# EasyEDA Pro project PUB3.epro

# Schematic Schematic1
Create Date: 2024-04-23; Page Name: P1; Project Name: PUB3; Schematic Name: Schematic1; Update Date: 2024-05-03; Company: 嘉立创EDA; Page Size: A4; Version: V1.0
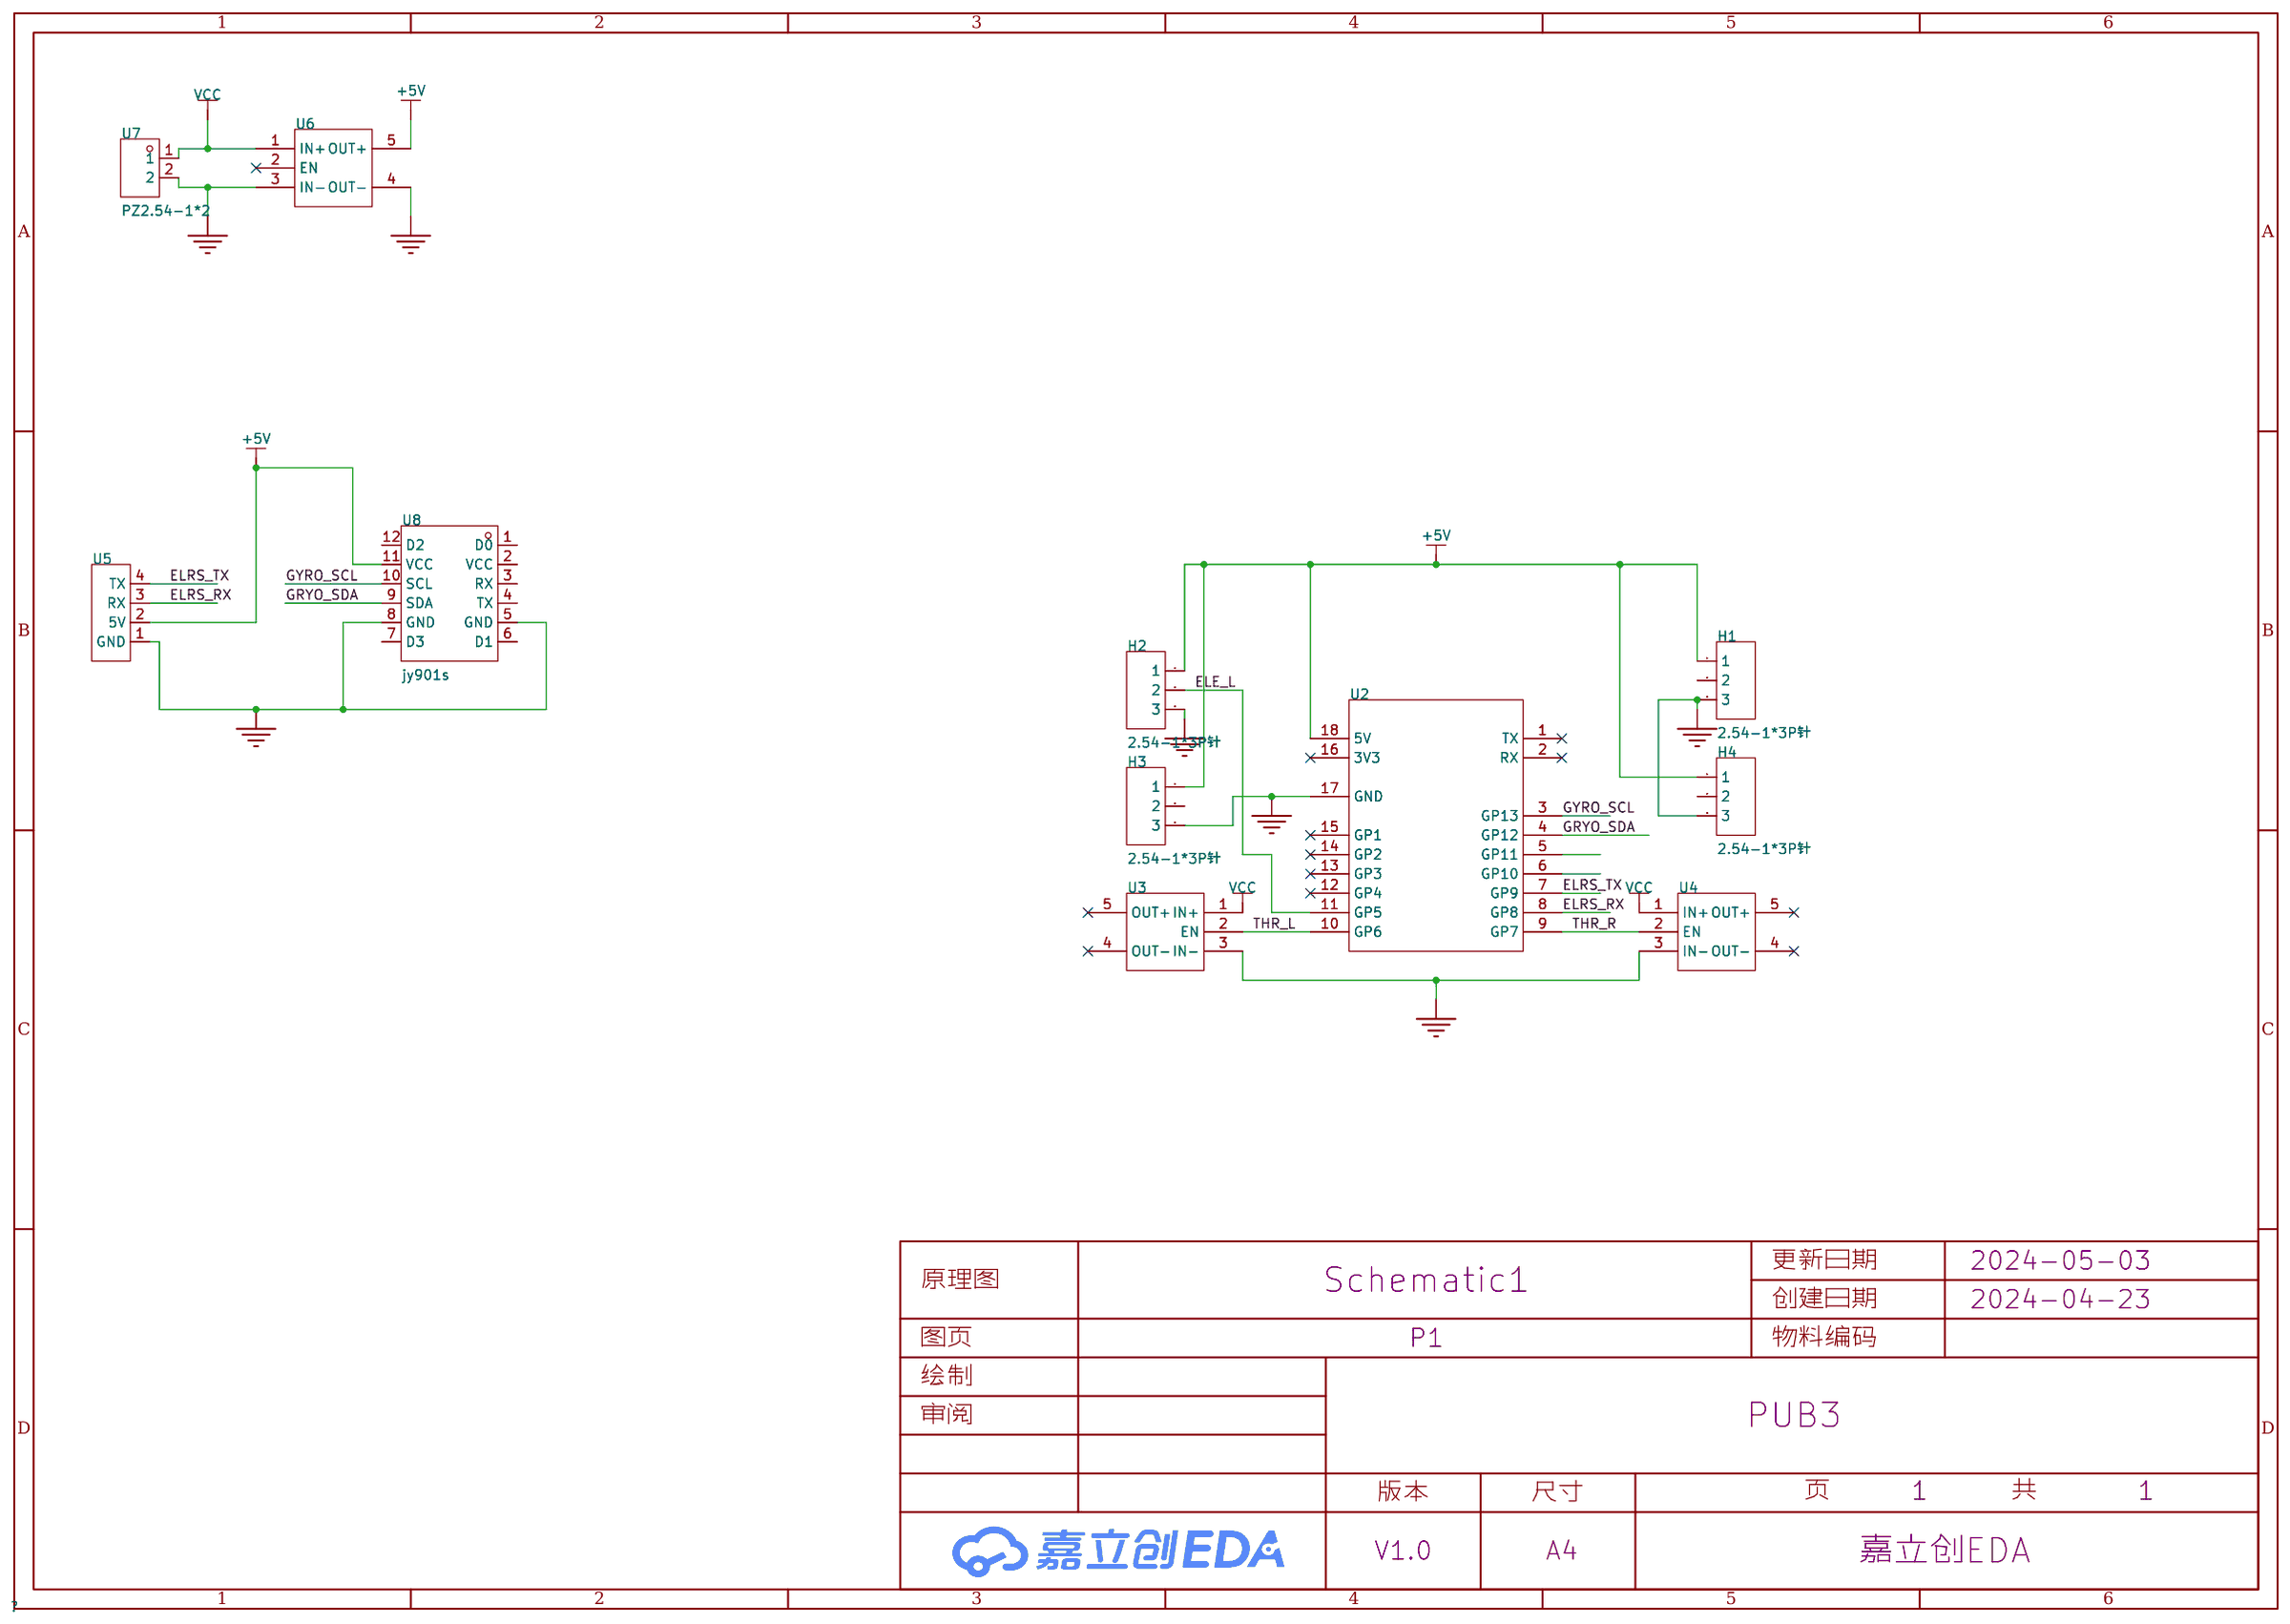
[diagram p0: schematic sheet]

## Parts
H1  2.54-1*3P针  [HDR-TH_3P-P2.54-V-M-1]
H2  2.54-1*3P针  [HDR-TH_3P-P2.54-V-M-1]
H3  2.54-1*3P针  [HDR-TH_3P-P2.54-V-M-1]
H4  2.54-1*3P针  [HDR-TH_3P-P2.54-V-M-1]
U2  -  [ESP32-S3-Zero]
U3  -  [带有使能端的DC-DC降压模块]
U4  -  [带有使能端的DC-DC降压模块]
U5  -  [ELRS焊盘]
U6  -  [带有使能端的DC-DC降压模块]
U7  PZ2.54-1*2  [HDR-TH_2P-P2.54-V-M-3]
U8  jy901s  [COMM-SMD_JY901S-1]

## Library data of the parts
H1-H4 = 2.54-1*3P针: 插针结构:1x3P;间距:2.54mm;行距:-;圆针/方针:方针;安装类型:直插;排数:单排;总PIN位数:3P;额定电流:3A;额定电压:-;配合针长度:-;塑高:-;端接针长度:-;触头材质:-;触头镀层:-;工作温度范围:-40℃~+105℃;颜色:黑色;; LCSC Part Name: 间距:2.54mm 1x3P 直插 方针; Supplier Part: C49257; Manufacturer: BOOMELE(博穆精密); Supplier Footprint: 插件,P=2.54mm; Datasheet: https://atta.szlcsc.com/upload/public/pdf/source/20221018/3E9408392E35E6F57A28985E5F7BF5C9.pdf; Supplier: LCSC; Pin Structure: 1x3P; Pitch: 2.54mm; Circluar Pins/Square Pins: 方针; Mounting Type: 直插; Number of Rows: 单排; Number of Pins: 3P; Current Rating (Max): 3A; Operating Temperature Range: -40℃~+105℃; Color: 黑色
U2 = ESP32-S3-Zero
U3 U4 U6 = 带有使能端的DC-DC降压模块
U5 = ELRS焊盘
U7 = PZ2.54-1*2: Supplier Part: C5360898; Manufacturer: ZHOURI(洲日); Supplier Footprint: 插件,P=2.54mm; JLCPCB Part Class: 扩展库; Datasheet: https://atta.szlcsc.com/upload/public/pdf/source/20220323/224B1BE3995440B78463F26874D564A6.pdf; Supplier: LCSC
U8 = jy901s: Supplier Part: C9900019525; Supplier Footprint: SMD; JLCPCB Part Class: 扩展库; Supplier: LCSC

## Nets
+5V: H1.1 H2.1 H3.1 H4.1 U2.18(5V) U5.2(5V) U6.5(OUT+) U8.11(VCC)
GND: H1.3 H2.3 H3.3 H4.3 U2.17(GND) U3.3(IN-) U4.3(IN-) U5.1(GND) U6.3(IN-) U6.4(OUT-) U7.2 U8.5(GND) U8.8(GND)
VCC: U3.1(IN+) U4.1(IN+) U6.1(IN+) U7.1
ELE_L: H2.2 U2.11(GP5)
ELRS_RX: U2.8(GP8) U5.3(RX)
ELRS_TX: U2.7(GP9) U5.4(TX)
GRYO_SDA: U2.4(GP12) U8.9(SDA)
GYRO_SCL: U2.3(GP13) U8.10(SCL)
THR_L: U2.10(GP6) U3.2(EN)
THR_R: U2.9(GP7) U4.2(EN)

Not connected (* = marked no-connect by the designer): H1 2; H3 2; H4 2; U2 1(TX)* 2(RX)* 5(GP11) 6(GP10) 12(GP4)* 13(GP3)* 14(GP2)* 15(GP1)* 16(3V3)*; U3 4(OUT-)* 5(OUT+)*; U4 4(OUT-)* 5(OUT+)*; U6 2(EN)*; U8 1(D0) 2(VCC) 3(RX) 4(TX) 6(D1) 7(D3) 12(D2)

# Board PCB1
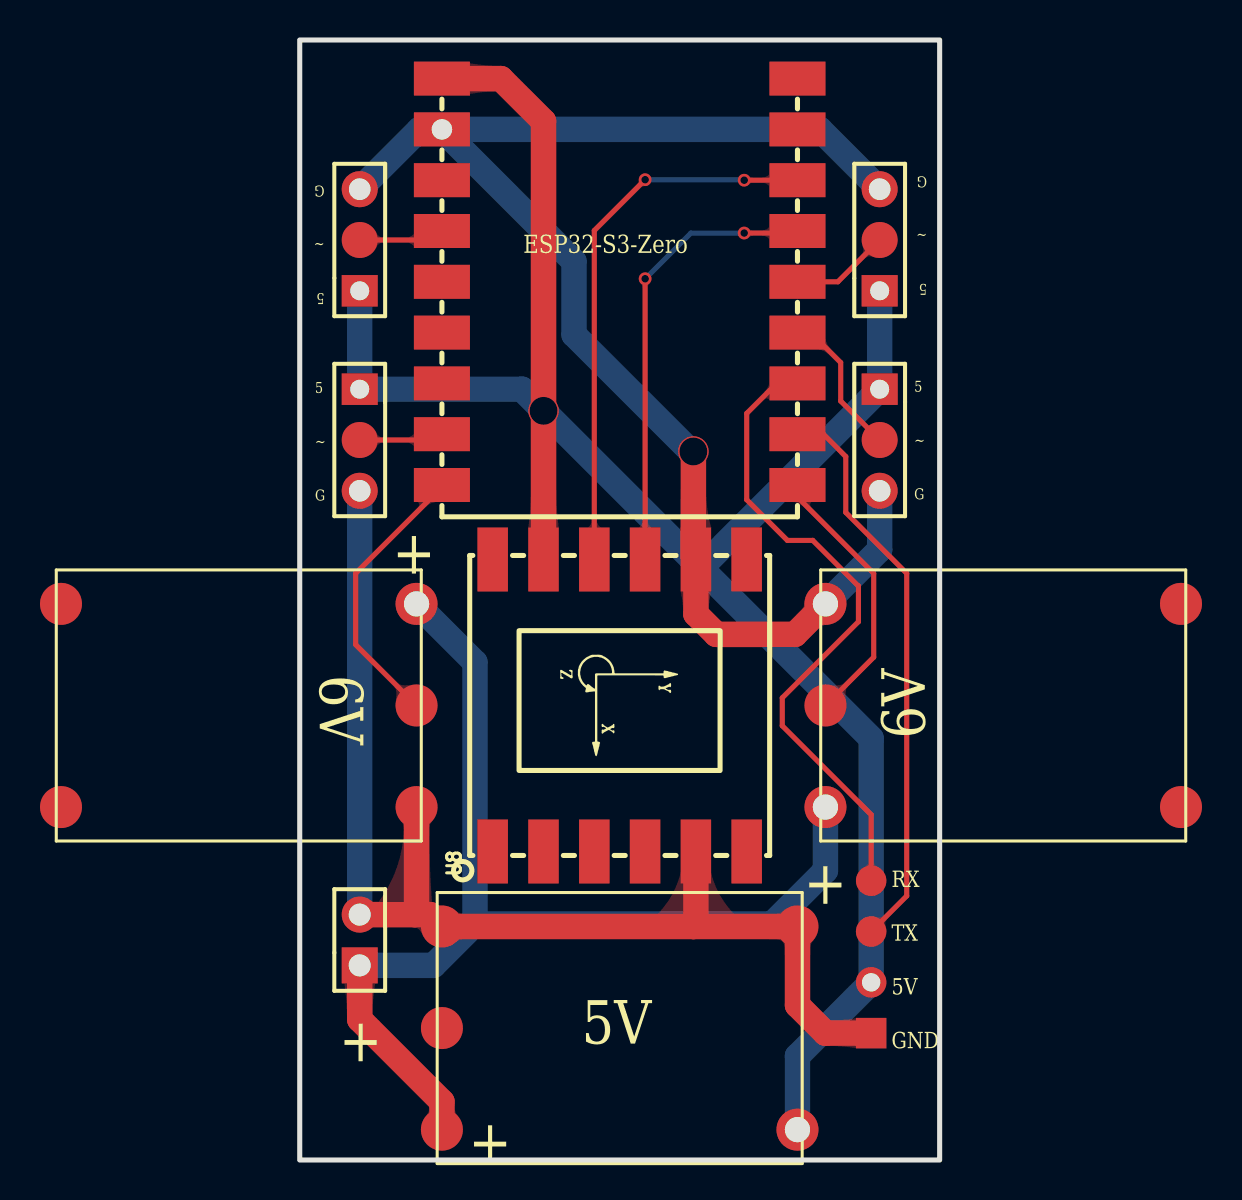
[diagram p1: board, top side]
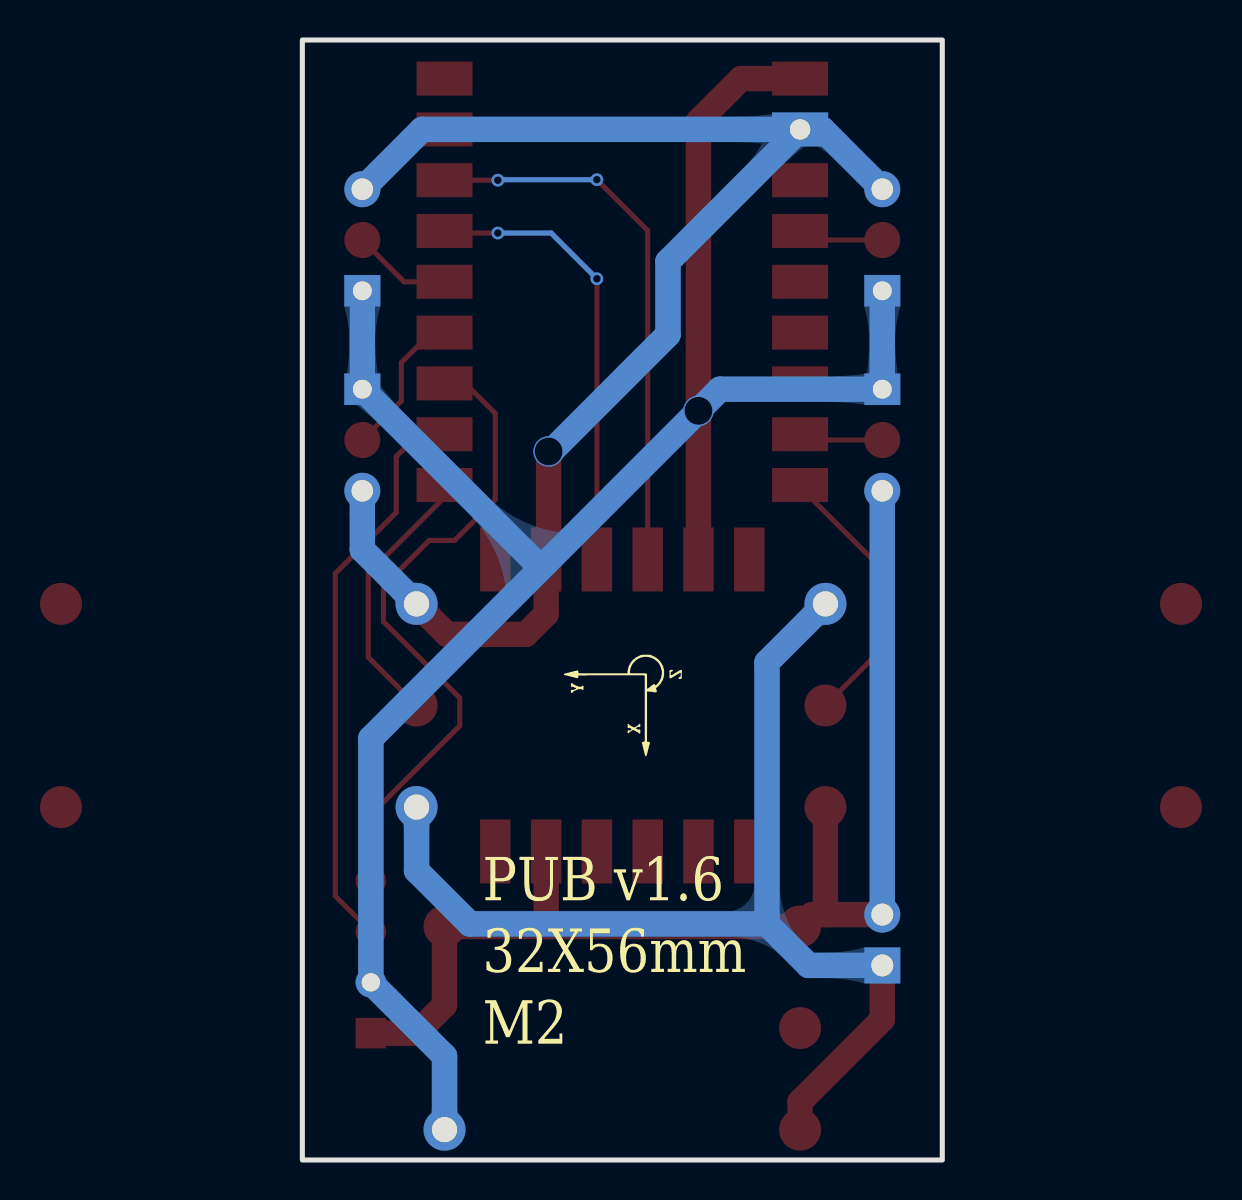
[diagram p2: board, bottom side, seen from below]

Outline 32 x 56 mm; copper layers: Top Layer, Bottom Layer. Coordinates in mm from the lower left corner of the outline.
Outline path: rectangle 0,56 32,0
Stack: Top Layer 0.035mm / Dielectric1 1.51mm FR4 er 4.5 / Bottom Layer 0.035mm

## Design rules (mm)
template: JLCPCB Capability(Two Layers Board)
spacing copperThickness1oz (default): track to track 0.102, other pairs 0.152 to 0.3
spacing copperThickness2oz: track to track 0.203, other pairs 0.152 to 0.3
track width copperThickness1oz (default): min 0.127, default 0.254, max 2.54
track width copperThickness2oz: min 0.203, default 0.254, max 2.54
differential pair differentialPair (default): width min 0.127, default 0.254, max 2.54; gap min 0.152, default 0.152
via viaSize (default): diameter min 0.5, default 0.61, max 10; hole min 0.3, default 0.305, max 6.3

## Placement (name value [footprint] x y rotation side)
H1  2.54-1*3P针  [HDR-TH_3P-P2.54-V-M-1]  29 36 270 top
H2  2.54-1*3P针  [HDR-TH_3P-P2.54-V-M-1]  3 36 270 top
H3  2.54-1*3P针  [HDR-TH_3P-P2.54-V-M-1]  3 46 90 top
H4  2.54-1*3P针  [HDR-TH_3P-P2.54-V-M-1]  29 46 90 top
U2  -  [ESP32-S3-Zero]  16 43 0 top
U3  -  [带有使能端的DC-DC降压模块#2]  5.84 27.81 180 top
U4  -  [带有使能端的DC-DC降压模块]  26.29 17.65 0 top
U5  -  [ELRS焊盘]  27.69 14.85 0 top
U6  -  [带有使能端的DC-DC降压模块#3]  7.11 1.52 0 top
U7  PZ2.54-1*2  [HDR-TH_2P-P2.54-V-M-3]  3 11 90 top
U8  jy901s  [COMM-SMD_JY901S-1]  16 22.73 90 top

## Footprints (pads in the part's own frame, mm; a bottom-side part is the same pattern mirrored in y, then rotated)
COMM-SMD_JY901S-1
  rect 3.2x1.524 smd: 1(-7.3,6.35) 2(-7.3,3.81) 3(-7.3,1.27) 4(-7.3,-1.27) 5(-7.3,-3.81) 6(-7.3,-6.35) 7(7.3,-6.35) 8(7.3,-3.81) 9(7.3,-1.27) 10(7.3,1.27) 11(7.3,3.81) 12(7.3,6.35)
ELRS焊盘
  rect 1.524x1.524 smd: 1(0.889,-8.509)
  round 1.524 hole 0.914: 2(0.889,-5.969)
  round 1.524 smd: 3(0.888,-3.429) 4(0.889,-0.889)
ESP32-S3-Zero
  rect 2.8x1.7 smd: 1(8.89,11.07) 2(8.89,8.53) 3(8.89,5.99) 4(8.89,3.45) 5(8.89,0.91) 6(8.89,-1.63) 7(8.89,-4.17) 8(8.89,-6.71) 9(8.89,-9.25) 10(-8.89,-9.25) 11(-8.89,-6.71) 12(-8.89,-4.17) 13(-8.89,-1.63) 14(-8.89,0.91) 15(-8.89,3.45) 16(-8.89,5.99) 18(-8.89,11.07)
  rect 2.8x1.7 hole 1.02: 17(-8.89,8.53)
HDR-TH_2P-P2.54-V-M-3
  rect 1.8x1.8 hole 1.1: 1(-1.27,0)
  round 1.8 hole 1.1: 2(1.27,0)
HDR-TH_3P-P2.54-V-M-1
  rect 1.575x1.8 hole 0.945: 1(-2.54,0)
  round 1.8 smd: 2(0,0)
  round 1.8 hole 1.08: 3(2.54,0)
带有使能端的DC-DC降压模块
  round 2.1 hole 1.26: 1(0,0) 3(0,10.16)
  round 2.1 smd: 2(0,5.08) 4(17.78,10.16) 5(17.78,0)
带有使能端的DC-DC降压模块#2
  round 2.1 hole 1.26: 1(0,0)
  round 2.1 smd: 2(0,5.08) 3(0,10.16) 4(17.78,10.16) 5(17.78,0)
带有使能端的DC-DC降压模块#3
  round 2.1 smd: 1(0,0) 2(0,5.08) 3(0,10.16) 4(17.78,10.16)
  round 2.1 hole 1.26: 5(17.78,0)

## Nets
As in the schematic.

Pads without a net: H1 2; H3 2; H4 2; U2 1 2 12 13 14 15 16; U3 4 5; U4 4 5; U6 2; U8 1 2 3 4 6 7 12

## Via types
v1: diameter 1.524, hole 1.397, Top Layer to Bottom Layer, 2 vias
v2: diameter 0.635, hole 0.381, Top Layer to Bottom Layer, 4 vias

## Routing (per net, layer and track width the routed paths; a pad name or vN(x,y) marks a point on that pad's centre or on a via; arc(x,y) is an arc through that point)
+5V: length 104.4
  Top Layer w1.27: U8.11 12.19,30.03 v1(12.19,37.46) 12.19,51.94 10.06,54.07 U2.18
  Bottom Layer w1.27: H4.1 H1.1 20.31,29.85 19.81,29.85 ; 19.81,29.85 28.57,21.08 U5.2 24.89,5.2 U6.5 ; 19.81,29.85 11.12,38.54 H2.1 H3.1
GND: length 133.1
  Top Layer w1.27: 19.69,11.67 7.11,11.67 U6.3 6.52,12.27 5.75,12.27 ; 19.69,11.67 19.81,11.8 U8.5 ; 19.69,11.67 24.89,11.67 ; 24.89,11.67 24.89,7.74 26.29,6.34 28.57,6.34 ; 24.89,11.67 U6.4 ; U4.3 24.76,26.28 20.83,26.28 19.81,27.3 U8.8 19.69,30.15 v1(19.69,35.43) ; 5.75,12.27 5.84,12.36 U3.3 ; 5.75,12.27 U7.2
  Bottom Layer w1.27: H3.3 5.99,51.53 U2.17 ; v1(19.69,35.43) 19.56,35.43 13.72,41.27 13.72,44.92 U2.17 ; U2.17 26.01,51.53 H4.3 ; U4.3 29,30.52 H1.3 ; U7.2 H2.3
VCC: length 55.2
  Top Layer w1.27: U6.1 7.11,1.52 7.11,2.91 3,7.03 U7.1
  Bottom Layer w1.27: U4.1 26.29,14.47 23.62,11.8 9.14,11.8 ; U7.1 6.69,9.73 8.76,11.8 8.76,24.89 U3.1
(no net): length 9.3
  Top Layer w0.254: H4.2 26.91,43.91 24.89,43.91 ; H3.2 6.66,46 U2.15
ELE_L: length 4.2
  Top Layer w0.254: H2.2 6.82,36 U2.11
ELRS_RX: length 28.6
  Top Layer w0.254: U2.8 26.19,36.29 27.31,35.17 27.31,32.38 30.35,29.33 30.35,13.2 U5.3
ELRS_TX: length 33
  Top Layer w0.254: U5.4 28.57,17.27 24.13,21.71 24.13,23.11 27.94,26.92 27.94,28.69 25.65,30.98 24.38,30.98 22.35,33.01 22.35,37.33 23.85,38.83 U2.7
GRYO_SDA: length 23
  Top Layer w0.254: U2.4 24.79,46.35 v2(22.22,46.35) ; 17.27,29.85 17.27,44.19
  Bottom Layer w0.254: v2(17.27,44.06) 19.56,46.35 v2(22.22,46.35)
GYRO_SCL: length 27.9
  Top Layer w0.254: U2.3 v2(22.22,48.99) ; 14.73,29.85 14.73,46.47 v2(17.27,49.02)
  Bottom Layer w0.254: v2(17.27,49.02) 22.2,49.02 v2(22.22,48.99)
THR_L: length 14.1
  Top Layer w0.254: U2.10 7.11,33.65 2.79,29.33 2.79,25.77 U3.2
THR_R: length 13.6
  Top Layer w0.254: U4.2 28.7,25.14 28.7,29.33 24.89,33.14 U2.9
$1N1075: length 7.5
  Top Layer w0.254: 29,36 27.05,37.95 27.05,39.87 25.55,41.37 U2.6

Small or netless copper shapes (teardrops, artwork), in the pictures only: 38 on Top Layer, 29 on Bottom Layer

## Text on the board
Bottom Silkscreen Layer: PUB v1.6 / 32X56mm / M2
Top Silkscreen Layer: 5 / ~ / G | RX / TX / 5V / GND | ESP32-S3-Zero | + | 5V | 6V
